# EAGLE design T_BoardV1.2 (EAGLE 5.06)
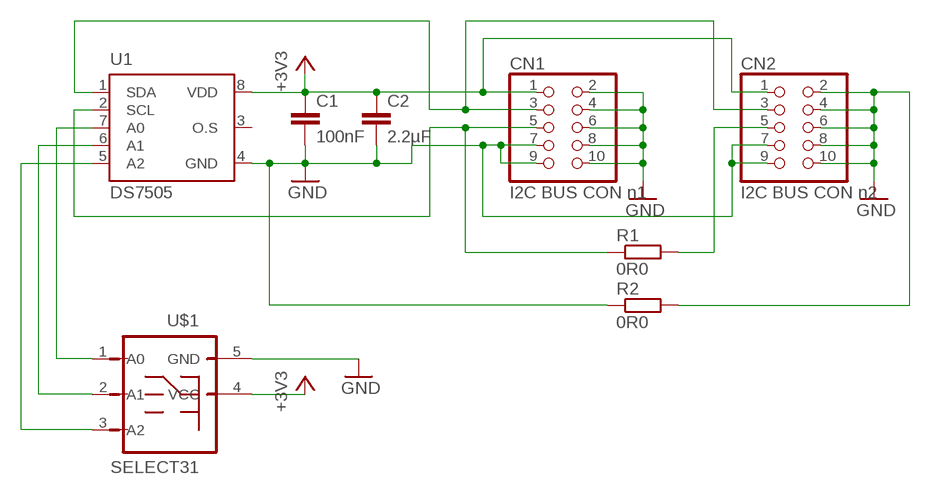
[diagram p0: schematic, sheet 1]

## Parts
C1  100nF  C-EUC0805  [C0805]
C2  2.2µF  C-EUC0805  [C0805]
CN1  I2C BUS CON n1  PIN1.27-2X5-  [2X05-TH1.27MM-LC]
CN2  I2C BUS CON n2  PIN1.27-2X5-  [2X05-TH1.27MM-LC]
R1  0R0  R-EU_R1206  [R1206]
R2  0R0  R-EU_R1206  [R1206]
U1  DS7505  [SO08]
U$1  SELECT31  [SELECT3]

## Nets
+3V3: C1.1 C2.1 CN1.1 CN2.1 U1.8(VDD) U$1.4(VCC)
GND: C1.2 C2.2 CN1.2 CN1.4 CN1.6 CN1.7 CN1.8 CN1.9 CN1.10 CN2.2 CN2.4 CN2.6 CN2.7 CN2.8 CN2.9 CN2.10 R2.1 R2.2 U1.4(GND) U$1.5(GND)
N$1: CN1.3 CN2.3 U1.1(SDA)
N$2: CN1.5 R1.1 U1.2(SCL)
N$3: U1.7(A0) U$1.1(A0)
N$4: U1.6(A1) U$1.2(A1)
N$5: U1.5(A2) U$1.3(A2)
N$6: CN2.5 R1.2
Unconnected: U1.3(O.S)

## Library data of the parts
C1 C2 = rcl:C-EU: CAPACITOR, European symbol
CN1 CN2 = my_lib:PIN1.27-2X5-: HARWIN Female-to-Male IDC Ribbon Cable Assembly 1.27mm Pitch DIL 10 Contacts, 2 rows
R1 R2 = rcl:R-EU_: RESISTOR, European symbol
U1 = my_lib:DS7505
U$1 = my_lib:SELECT3

## Board
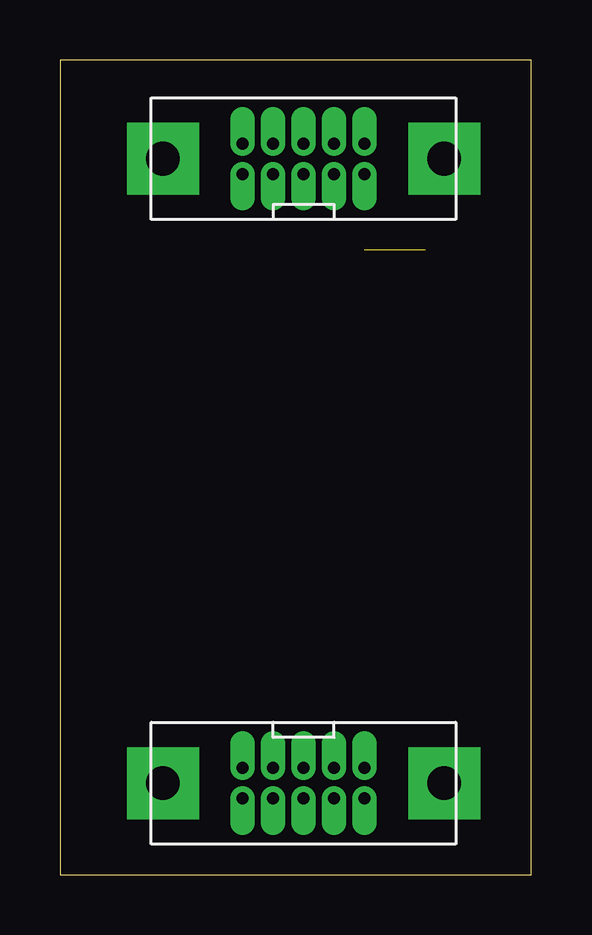
[diagram p1: board, top side]
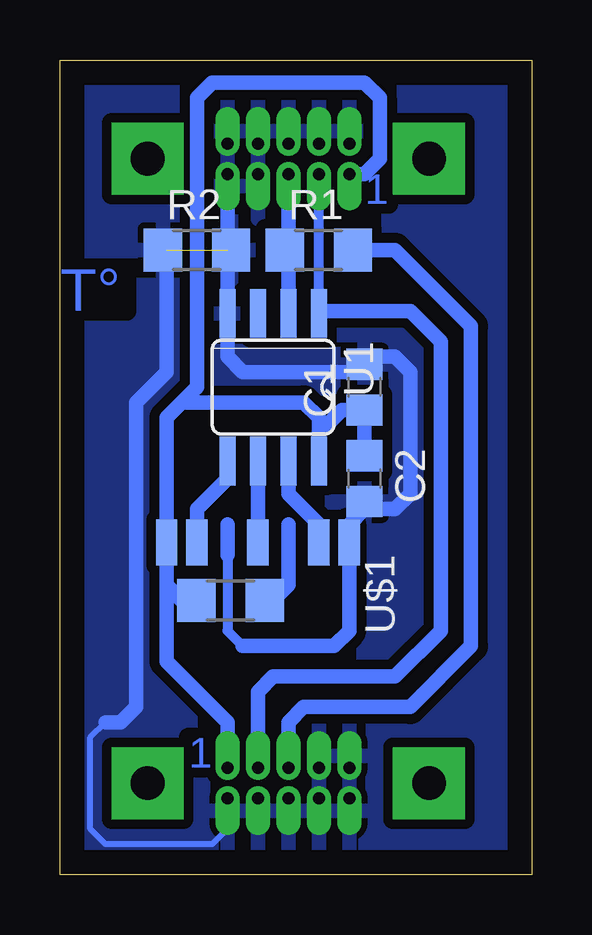
[diagram p2: board, bottom side, seen from below]

Size 19.66 x 33.96 mm. Coordinates in mm from the lower left corner, seen from the top.
Outline: 0,0 19.66,0 19.66,33.96 0,33.96 0,0
Copper layers (1*16): Top 0.035mm / dielectric 1.5mm / Bottom 0.035mm
Design rules "default": minimum track width 10mil, minimum drill 24mil, track to track 8mil, track to pad 8mil, pad to pad 8mil, via to via 8mil, smd to smd 8mil, copper to edge 40mil, drill to drill 8mil, minimum pad ring 10mil, minimum via ring 8mil, stop-mask expansion 4mil, vias tented up to drill 0mil, thermal gap 10mil

### Footprints (pad centres in the part's own frame; a part is rotated, then mirrored left to right if it is on the bottom)
C0805 = smd 1.3 x 1.5: 1 -0.95,0; 2 0.95,0
2X05-TH1.27MM-LC = drill 0.5 pad 1.016 offset: 1 -2.54,-0.635; 2 -2.54,0.635; 3 -1.27,-0.635; 4 -1.27,0.635; 5 0,-0.635; 6 0,0.635; 7 1.27,-0.635; 8 1.27,0.635; 9 2.54,-0.635; 10 2.54,0.635 | drill 1.4 pad 3 square: P$11 -5.867,0; P$12 5.867,0
R1206 = smd 1.6 x 1.803: 1 -1.422,0; 2 1.422,0
SO08 = smd 0.66 x 2.032: 1 -1.905,-3.073; 2 -0.635,-3.073; 3 0.635,-3.073; 4 1.905,-3.073; 5 1.905,3.073; 6 0.635,3.073; 7 -0.635,3.073; 8 -1.905,3.073
SELECT3 = smd 1.905 x 0.889: 1 -3.048,0; 2 -3.048,-2.54; 3 -3.048,-5.08; 4 -3.048,-6.35; 5 -3.048,1.27 | smd 1.803 x 1.6: X -0.635,-2.261; Y -0.635,-5.105

### Placement (x,y rotation side)
C1  6.98,20.32 90 bottom
C2  6.98,16.51 270 bottom
CN1  10.16,29.84 0 top
CN2  10.16,3.81 180 top
R1  8.89,26.04 0 bottom
R2  13.97,26.04 0 bottom
U1  10.8,20.32 180 bottom
U$1  8.89,10.8 270 bottom

### Tracks (layer width: path | path; a pad name or v marks a point on that pad's centre or on a via)
+3V3
  Bottom 0.61: 8.89,18.41 8.89,19.05 9.53,19.69 14.61,19.69 | 8.89,18.41 U1.8 | 8.89,18.41 7.94,19.37 C1.1 C2.1 | 14.61,19.69 15.24,19.05 U$1.4 15.24,8.89 12.7,6.35 CN2.1 | CN1.1 6.98,29.21 6.35,29.84 6.35,32.38 6.98,33.02 13.34,33.02 13.97,32.38 13.97,20.32 14.61,19.69
GND  (1 unrouted)
  Bottom 0.254: 17.78,6.35 18.41,5.71 18.41,1.91 17.78,1.27 13.34,1.27 12.7,1.91 CN2.2
  Bottom 0.61: U1.4 12.7,21.59 12.07,20.95 7.3,20.95 C1.2 6.66,21.59 5.72,21.59 5.08,20.95 5.08,15.88 5.72,15.24 6.66,15.24 | 6.66,15.24 C2.2 | 6.66,15.24 6.98,15.24 7.62,14.61 U$1.5 | U1.4 12.7,24.77 | 12.7,26.04 R2.2 | 12.7,26.04 CN1.9 | R2.1 15.24,26.04 15.24,20.95 16.51,19.69 16.51,6.98 17.15,6.35 17.78,6.35 | U1.4 12.7,26.04
  pour Bottom (isolate 0.406): 0,33.66 19.69,33.66 19.69,0 0,0
N$1
  Bottom 0.406: U1.1 CN1.3
  Bottom 0.61: CN2.3 11.43,7.62 10.8,8.26 5.72,8.26 3.81,10.16 3.81,22.23 5.08,23.5 8.79,23.5 U1.1
N$2
  Bottom 0.61: 10.16,22.86 U1.2 10.16,26.04 | 10.16,26.04 CN1.5 | 10.16,26.04 R1.1
N$3
  Bottom 0.61: U1.7 10.16,15.88 8.89,14.61 U$1.1
N$4
  Bottom 0.61: U$1.2 U1.6
N$5
  Bottom 0.61: U1.5 12.7,16.51 13.97,15.24 U$1.3
N$6
  Bottom 0.61: CN2.5 10.16,6.35 9.53,6.98 5.08,6.98 2.54,9.52 2.54,22.86 5.72,26.04 R1.2

### Text on the board
Bottom: T°